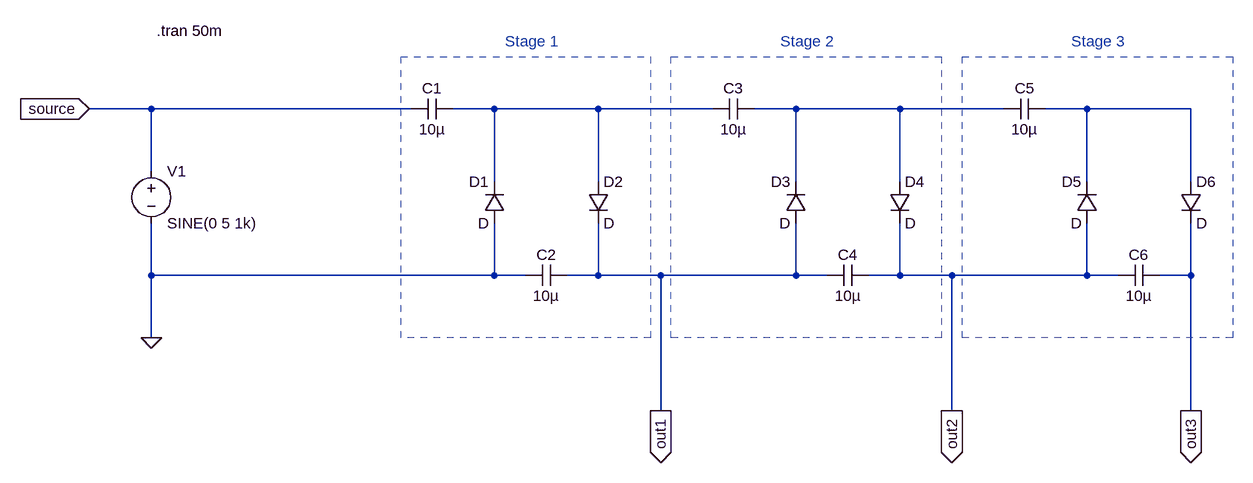
[diagram p0: schematic voltage-multiplier.asc]
voltage-multiplier.asc, the LTspice schematic file:
Version 4
SHEET 1 1940 752
WIRE 256 176 160 176
WIRE 656 176 256 176
WIRE 784 176 720 176
WIRE 944 176 784 176
WIRE 1120 176 944 176
WIRE 1248 176 1184 176
WIRE 1408 176 1248 176
WIRE 1568 176 1408 176
WIRE 1696 176 1632 176
WIRE 1856 176 1696 176
WIRE 256 272 256 176
WIRE 784 288 784 176
WIRE 944 288 944 176
WIRE 1248 288 1248 176
WIRE 1408 288 1408 176
WIRE 1696 288 1696 176
WIRE 1856 288 1856 176
WIRE 256 432 256 352
WIRE 784 432 784 352
WIRE 784 432 256 432
WIRE 832 432 784 432
WIRE 944 432 944 352
WIRE 944 432 896 432
WIRE 1040 432 944 432
WIRE 1248 432 1248 352
WIRE 1248 432 1040 432
WIRE 1296 432 1248 432
WIRE 1408 432 1408 352
WIRE 1408 432 1360 432
WIRE 1488 432 1408 432
WIRE 1696 432 1696 352
WIRE 1696 432 1488 432
WIRE 1744 432 1696 432
WIRE 1856 432 1856 352
WIRE 1856 432 1808 432
WIRE 256 528 256 432
WIRE 1040 640 1040 432
WIRE 1488 640 1488 432
WIRE 1856 640 1856 432
FLAG 256 528 0
FLAG 1040 640 out1
IOPIN 1040 640 Out
FLAG 1488 640 out2
IOPIN 1488 640 Out
FLAG 1856 640 out3
IOPIN 1856 640 Out
FLAG 160 176 source
IOPIN 160 176 In
SYMBOL voltage 256 256 R0
WINDOW 123 0 0 Left 0
WINDOW 39 0 0 Left 0
SYMATTR InstName V1
SYMATTR Value SINE(0 5 1k)
SYMBOL cap 720 160 R90
WINDOW 0 0 32 VBottom 2
WINDOW 3 32 32 VTop 2
SYMATTR InstName C1
SYMATTR Value 10µ
SYMBOL diode 800 352 R180
WINDOW 0 24 64 Left 2
WINDOW 3 24 0 Left 2
SYMATTR InstName D1
SYMBOL cap 896 416 R90
WINDOW 0 0 32 VBottom 2
WINDOW 3 32 32 VTop 2
SYMATTR InstName C2
SYMATTR Value 10µ
SYMBOL diode 928 288 R0
SYMATTR InstName D2
SYMBOL cap 1184 160 R90
WINDOW 0 0 32 VBottom 2
WINDOW 3 32 32 VTop 2
SYMATTR InstName C3
SYMATTR Value 10µ
SYMBOL diode 1264 352 R180
WINDOW 0 24 64 Left 2
WINDOW 3 24 0 Left 2
SYMATTR InstName D3
SYMBOL cap 1360 416 R90
WINDOW 0 0 32 VBottom 2
WINDOW 3 32 32 VTop 2
SYMATTR InstName C4
SYMATTR Value 10µ
SYMBOL diode 1392 288 R0
SYMATTR InstName D4
SYMBOL cap 1632 160 R90
WINDOW 0 0 32 VBottom 2
WINDOW 3 32 32 VTop 2
SYMATTR InstName C5
SYMATTR Value 10µ
SYMBOL diode 1712 352 R180
WINDOW 0 24 64 Left 2
WINDOW 3 24 0 Left 2
SYMATTR InstName D5
SYMBOL cap 1808 416 R90
WINDOW 0 0 32 VBottom 2
WINDOW 3 32 32 VTop 2
SYMATTR InstName C6
SYMATTR Value 10µ
SYMBOL diode 1840 288 R0
SYMATTR InstName D6
TEXT 264 56 Left 2 !.tran 50m
TEXT 800 72 Left 2 ;Stage 1
TEXT 1224 72 Left 2 ;Stage 2
TEXT 1672 72 Left 2 ;Stage 3
RECTANGLE Normal 1024 528 640 96 2
RECTANGLE Normal 1472 528 1056 96 2
RECTANGLE Normal 1920 528 1504 96 2

The netlist it stands for:
* voltage-multiplier.asc
V1 source 0 SINE(0 5 1k)
C1 N001 source 10µ
D1 0 N001 D
C2 out1 0 10µ
D2 N001 out1 D
C3 N002 N001 10µ
D3 out1 N002 D
C4 out2 out1 10µ
D4 N002 out2 D
C5 N003 N002 10µ
D5 out2 N003 D
C6 out3 out2 10µ
D6 N003 out3 D
.model D D
.lib standard.dio
.tran 50m
* Stage 1
* Stage 2
* Stage 3
.backanno
.end